# EAGLE design oddelovac (EAGLE 7.3.0)
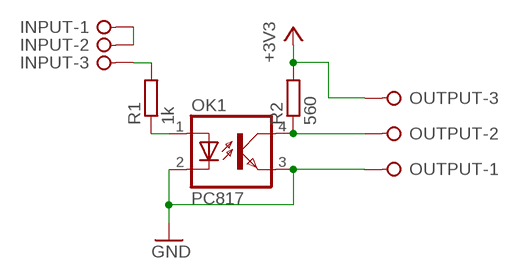
[diagram p0: schematic, sheet 1]

## Parts
INPUT  W237-3E  [W237-3E]
OK1  PC817  [DIL04]
OUTPUT  W237-3E  [W237-3E]
R1  1k  R-EU_0207/7  [0207/7]
R2  560  R-EU_0207/7  [0207/7]

## Nets
+3V3: OUTPUT.3 R2.2
GND: OK1.2(C) OK1.3(EMIT) OUTPUT.1
N$1: INPUT.3 R1.2
N$2: OK1.1(A) R1.1
N$3: OK1.4(COL) OUTPUT.2 R2.1
N$4: INPUT.1 INPUT.2

## Library data of the parts
INPUT OUTPUT = con-wago-508:W237-3E: WAGO SREW CLAMP; OC_FARNELL: unknown; OC_NEWARK: unknown
OK1 = optocoupler:PC817: SHARP OPTO COUPLER; MPN: PC817X4J000F; OC_FARNELL: 9707727; OC_NEWARK: 97K7059
R1 R2 = rcl:R-EU_: RESISTOR, European symbol

## Board
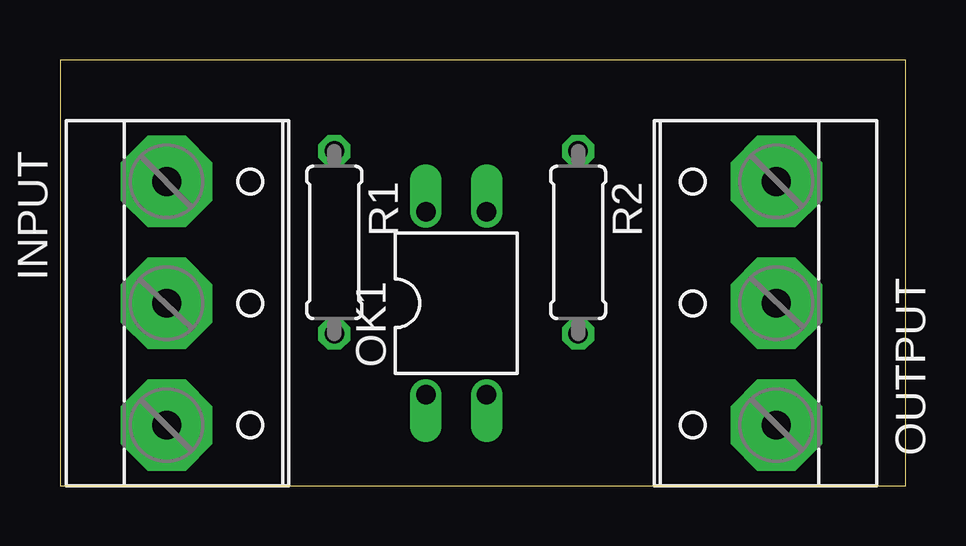
[diagram p1: board, top side]
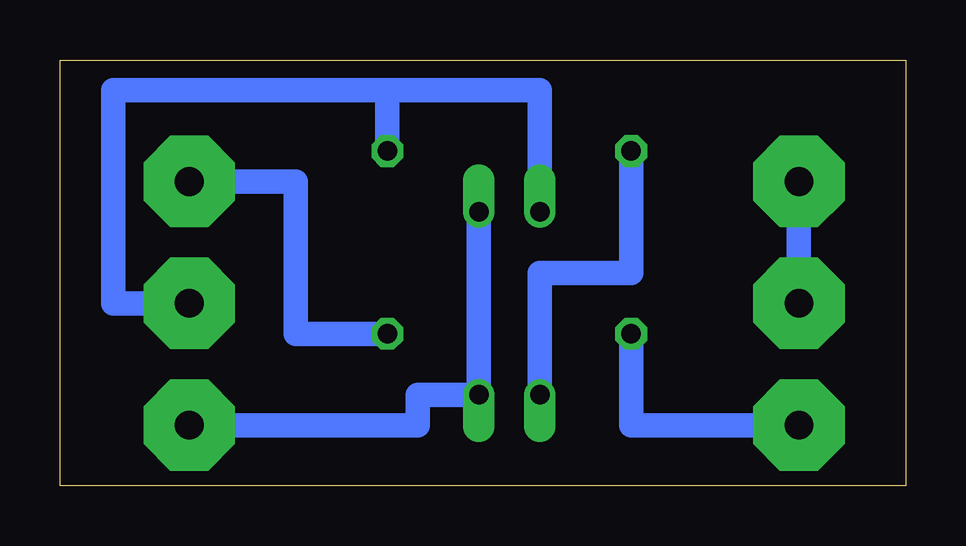
[diagram p2: board, bottom side, seen from below]

Size 35.23 x 17.77 mm. Coordinates in mm from the lower left corner, seen from the top.
Outline: 0,0 35.23,0 35.23,17.77 0,17.77 0,0
Copper layers (1*16): Top 0.035mm / dielectric 1.5mm / Bottom 0.035mm
Design rules "default": minimum track width 10mil, minimum drill 24mil, track to track 8mil, track to pad 8mil, pad to pad 8mil, via to via 8mil, smd to smd 8mil, copper to edge 40mil, drill to drill 8mil, minimum pad ring 10mil, minimum via ring 8mil, stop-mask expansion 4mil, vias tented up to drill 0mil, thermal gap 10mil

### Footprints (pad centres in the part's own frame; a part is rotated, then mirrored left to right if it is on the bottom)
W237-3E = drill 1.194 pad 3.81 octagon: 1 -5.08,-0.635; 2 0,-0.635; 3 5.08,-0.635
DIL04 = drill 0.813 offset: 1 -1.27,-3.81; 2 1.27,-3.81; 3 1.27,3.81; 4 -1.27,3.81
0207/7 = drill 0.813 octagon: 1 -3.81,0; 2 3.81,0

### Placement (x,y rotation side)
INPUT  5.08,7.62 270 top
OK1  16.51,7.62 0 top
OUTPUT  29.21,7.62 90 top
R1  11.43,10.16 270 top
R2  21.59,10.16 270 top

### Tracks (layer width: path | path; a pad name or v marks a point on that pad's centre or on a via)
+3V3
  Bottom 1.016: R2.2 25.4,6.35 25.4,12.7 OUTPUT.3
GND
  Bottom 1.016: OK1.3 OK1.2 20.32,3.81 20.32,2.54 OUTPUT.1
N$1
  Bottom 1.016: INPUT.3 11.43,2.54 R1.2
N$2
  Bottom 1.016: R1.1 11.43,8.89 15.24,8.89 OK1.1
N$3
  Bottom 1.016: R2.1 21.59,16.51 | 21.59,16.51 15.24,16.51 OK1.4 | OUTPUT.2 33.02,7.62 33.02,16.51 21.59,16.51
N$4
  Bottom 1.016: INPUT.1 INPUT.2